# EAGLE schematic ReflowOvenController (EAGLE 6.4)
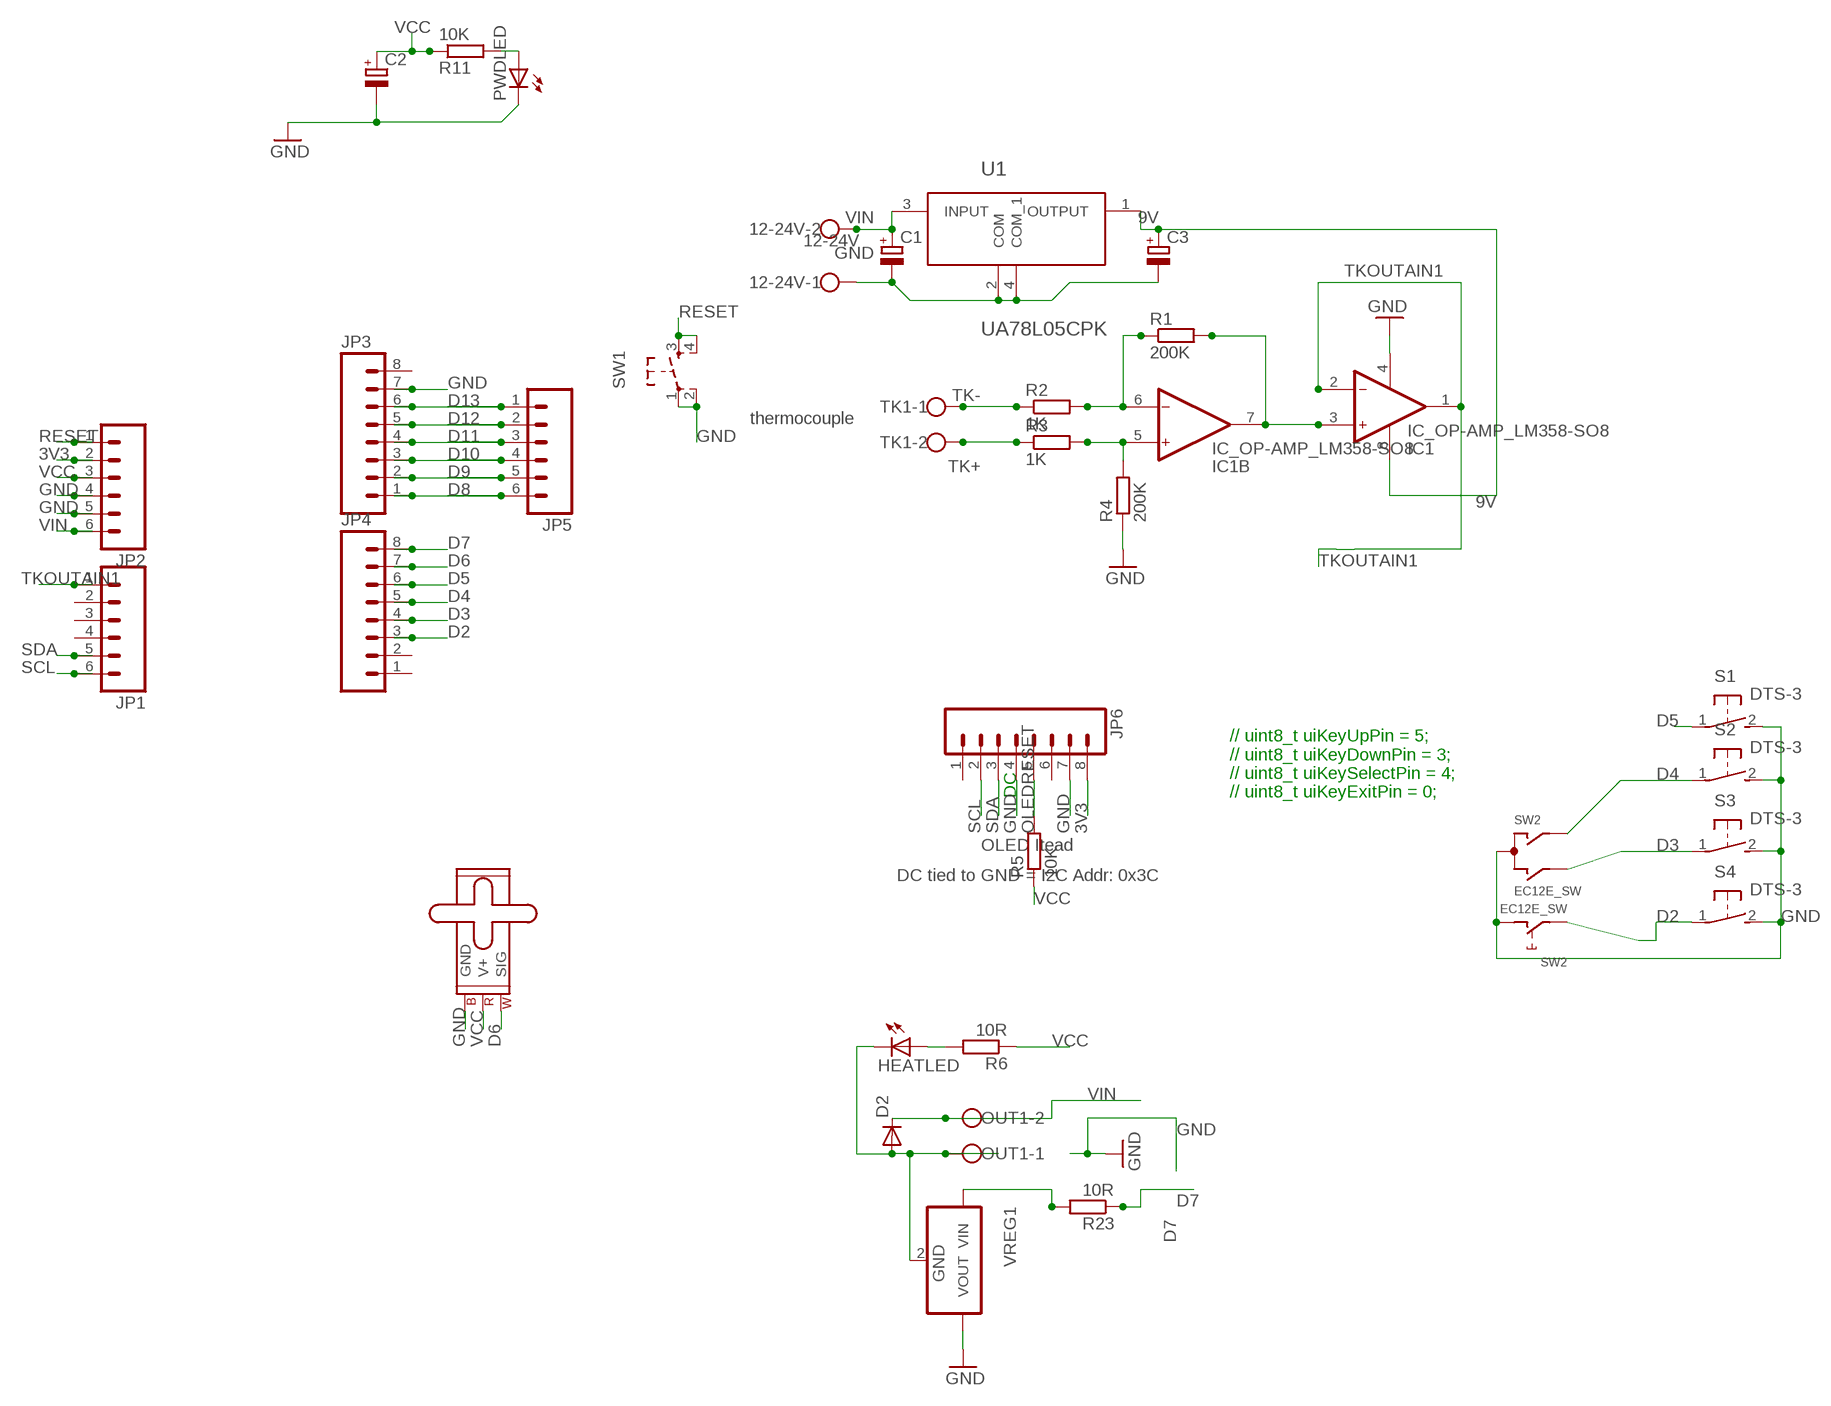
[diagram p0: schematic, sheet 1]

## Parts
12-24V  W237-102  [W237-102]
C1  CPOL-EU153CLV-0505  [153CLV-0505]
C2  CPOL-EU153CLV-0505  [153CLV-0505]
C3  CPOL-EU153CLV-0505  [153CLV-0505]
D2  DIODESMA-ALT  [SMA-DIODE_ALT]
HEATLED  LEDCHIPLED_1206  [CHIPLED_1206]
IC1  IC_OP-AMP_LM358-SO8  [SO-8]
JP1  M06LOCK_LONGPADS  [1X06_LOCK_LONGPADS]
JP2  M06LOCK_LONGPADS  [1X06_LOCK_LONGPADS]
JP3  M08LOCK_LONGPADS  [1X08_LOCK_LONGPADS]
JP4  M08LOCK_LONGPADS  [1X08_LOCK_LONGPADS]
JP5  M06LOCK_LONGPADS  [1X06_LOCK_LONGPADS]
JP6  M08LOCK  [1X08_LOCK]
OUT1  W237-102  [W237-102]
PWDLED  LEDCHIPLED_1206  [CHIPLED_1206]
R1  200K  R-EU_M1206  [M1206]
R2  1K  R-EU_M1206  [M1206]
R3  1K  R-EU_M1206  [M1206]
R4  200K  R-EU_M1206  [M1206]
R5  10K  RESISTOR-1206  [R1206]
R6  10R  R-EU_M1206  [M1206]
R11  10K  RESISTOR-1206  [R1206]
R23  10R  R-EU_M1206  [M1206]
S1  DTS-3  [DTS-3]
S2  DTS-3  [DTS-3]
S3  DTS-3  [DTS-3]
S4  DTS-3  [DTS-3]
SERVO  SMALL_SERVO  [1X03]
SW1  SW_TACT_4P  [SW_TACT_SMALL]
SW2  EC12E_SW  [ALPS_EC12E_SW]
TK1  W237-102  [W237-102]
U1  UA78L05CPK  [SOT150P400X160-4N]
VREG1  VREG_3PINS-D2PAK  [D2PAK]

## Nets
3V3: JP2.2 JP6.8
9V: C3.+ IC1.8(V+) U1.1(OUTPUT)
D2: JP4.3 S4.1 SW2.E
D3: JP4.4 S3.1 SW2.B
D4: JP4.5 S2.1 SW2.A
D5: JP4.6 S1.1
D6: JP4.7 SERVO.1(SIG)
D7: JP4.8 R23.1
D8: JP3.1 JP5.6
D9: JP3.2 JP5.5
D10: JP3.3 JP5.4
D11: JP3.4 JP5.3
D12: JP3.5 JP5.2
D13: JP3.6 JP5.1
GND: 12-24V.1 C1.- C2.- C3.- IC1.4(V-) JP2.4 JP2.5 JP3.7 JP6.4 JP6.7 PWDLED.C R4.1 S1.2 S2.2 S3.2 S4.2 SERVO.3(GND) SW1.1 SW1.2 SW2.C SW2.D U1.2(COM) U1.4(COM_1) VREG1.3(VOUT)
MSFTOUT1: D2.A HEATLED.C OUT1.1 VREG1.2(GND)
N$1: IC1.3(+) IC1.7(OUT) R1.2
N$2: IC1.6(-) R1.1 R2.2
N$3: IC1.5(+) R3.2 R4.2
N$4: HEATLED.A R6.2
N$12: PWDLED.A R11.2
N$43: R23.2 VREG1.1(VIN)
OLEDRESET: JP6.5 R5.2
RESET: JP2.1 SW1.3 SW1.4
SCL: JP1.6 JP6.2
SDA: JP1.5 JP6.3
TK+: R3.1 TK1.2
TK-: R2.1 TK1.1
TKOUTAIN1: IC1.1(OUT) IC1.2(-) JP1.1
VCC: C2.+ JP2.3 R5.1 R6.1 R11.1 SERVO.2(V+)
VIN: 12-24V.2 C1.+ D2.C JP2.6 OUT1.2 U1.3(INPUT)
Unconnected: JP1.2 JP1.3 JP1.4 JP3.8 JP4.1 JP4.2 JP6.1 JP6.6 SW2.GND1(G) SW2.GND2(G)

## Notes on the sheet
- 12-24V
- thermocouple
- DC
- // uint8_t uiKeyUpPin = 5;
  // uint8_t uiKeyDownPin = 3;
  // uint8_t uiKeySelectPin = 4;
  // uint8_t uiKeyExitPin = 0;
- OLED Itead
- DC tied to GND = I2C Addr: 0x3C

## Library data of the parts
12-24V OUT1 TK1 = con-wago-500:W237-102: WAGO SCREW CLAMP; MPN: 237-102; OC_FARNELL: unknown; OC_NEWARK: 70K9898
C1-C3 = resistor:CPOL-EU: POLARIZED CAPACITOR, European symbol
D2 = SparkFun-DiscreteSemi:DIODE: Diode These are standard reverse protection diodes and small signal diodes. SMA package can handle up to about 1A. SOD-323 can handle about 200mA. What the SOD-323 package when ordering, there are some mfgs out there that are 5-pin packages.
HEATLED PWDLED = led:LED: LED OSRAM: - CHIPLED LG R971, LG N971, LY N971, LG Q971, LY Q971, LO R971, LY R971 LH N974, LH R974 LS Q976, LO Q976, LY Q976 LO Q996 - Hyper CHIPLED LW Q18S LB Q993, LB Q99A, LB R99A - SideLED LS A670, LO A670, LY A670, LG A670, LP A670 LB A673, LV A673, LT A673, LW A673 LH A674 LY A675 LS A676, LA A676, LO A676, LY A676, LW A676 LS A679, LY A679, LG A679 - Hyper Micro SIDELED® LS Y876, LA Y876, LO Y876, LY Y876 LT Y87S - SmartLED LW L88C, LW L88S LB L89C, LB L89S, LG L890 LS L89K, LO L89K, LY L89K LS L896, LA L896, LO L896, LY L896 - TOPLED LS T670, LO T670, LY T670, LG T670, LP T670 LSG T670, LSP T670, LSY T670, LOP T670, LYG T670 LG T671, LOG T671, LSG T671 LB T673, LV T673, LT T673, LW T673 LH T674 LS T676, LA T676, LO T676, LY T676, LB T676, LH T676, LSB T676, LW T676 LB T67C, LV T67C, LT T67C, LS T67K, LO T67K, LY T67K, LW E67C LS E67B, LA E67B, LO E67B, LY E67B, LB E67C, LV E67C, LT E67C LW T67C LS T679, LY T679, LG T679 LS T770, LO T770, LY T770, LG T770, LP T770 LB T773, LV T773, LT T773, LW T773 LH T774 LS E675, LA E675, LY E675, LS T675 LS T776, LA T776, LO T776, LY T776, LB T776 LHGB T686 LT T68C, LB T68C - Hyper Mini TOPLED® LB M676 - Mini TOPLED Santana® LG M470 LS M47K, LO M47K, LY M47K Source: http://www.osram.convergy.de LUXEON: - LUMILED® LXK2-PW12-R00, LXK2-PW12-S00, LXK2-PW14-U00, LXK2-PW14-V00 LXK2-PM12-R00, LXK2-PM12-S00, LXK2-PM14-U00 LXK2-PE12-Q00, LXK2-PE12-R00, LXK2-PE12-S00, LXK2-PE14-T00, LXK2-PE14-U00 LXK2-PB12-K00, LXK2-PB12-L00, LXK2-PB12-M00, LXK2-PB14-N00, LXK2-PB14-P00, LXK2-PB14-Q00 LXK2-PR12-L00, LXK2-PR12-M00, LXK2-PR14-Q00, LXK2-PR14-R00 LXK2-PD12-Q00, LXK2-PD12-R00, LXK2-PD12-S00 LXK2-PH12-R00, LXK2-PH12-S00 LXK2-PL12-P00, LXK2-PL12-Q00, LXK2-PL12-R00 Source: www.luxeon.com KINGBRIGHT: KA-3528ASYC Source: www.kingbright.com
IC1 = dp_devices:IC_OP-AMP_LM358: Dual op-amp
JP1 JP2 JP5 = SparkFun-Connectors:M06: Header 6 Standard 6-pin 0.1" header. Use with straight break away headers (SKU : PRT-00116), right angle break away headers (PRT-00553), swiss pins (PRT-00743), machine pins (PRT-00117), and female headers (PRT-00115). Molex polarized connector foot print use with SKU : PRT-08094 with associated crimp pins and housings. NOTES ON THE VARIANTS LOCK and LOCK_LONGPADS... This footprint was designed to help hold the alignment of a through-hole component (i.e. 6-pin header) while soldering it into place. You may notice that each hole has been shifted either up or down by 0.005 of an inch from it's more standard position (which is a perfectly straight line). This slight alteration caused the pins (the squares in the middle) to touch the edges of the holes. Because they are alternating, it causes a "brace" to hold the component in place. 0.005 has proven to be the perfect amount of "off-center" position when using our standard breakaway headers. Although looks a little odd when you look at the bare footprint, once you have a header in there, the alteration is very hard to notice. Also,if you push a header all the way into place, it is covered up entirely on the bottom side. This idea of altering the position of holes to aid alignment will be further integrated into the Sparkfun Library for other footprints. It can help hold any component with 3 or more connection pins.
JP3 JP4 JP6 = SparkFun-Connectors:M08: Header 8 Standard 8-pin 0.1" header. Use with straight break away headers (SKU : PRT-00116), right angle break away headers (PRT-00553), swiss pins (PRT-00743), machine pins (PRT-00117), and female headers (PRT-00115).
R1-R4 R6 R23 = resistor:R-EU_: RESISTOR, European symbol
R5 R11 = dp_devices:RESISTOR
S1-S4 = switch-tact:DTS-3
SERVO = SparkFun-Electromechanical:SMALL_SERVO: Small servo motor This is the small servo used in the SIK. SKU: ROB-09065
SW1 = dp_devices:SW_TACT_4P
SW2 = switch-alps:EC12E_SW: ALPS rotary Encoder EC12E series with switch; MPN: EC12E2424407; OC_FARNELL: 1520813; OC_NEWARK: 74M1068
U1 = TI-Eagle_library:UA78L05: μA78L00 SERIES POSITIVE-VOLTAGE REGULATORS,SOT-89-3; MPN: UA78L05CPK; OC_FARNELL: 2112604; OC_NEWARK: 77C1862; PACKAGE: SOT-89-3; SUPPLIER: TEXAS INSTRUMENTS
VREG1 = dp_devices:VREG_3PINS: Various 3 pin voltage regulators in different packages Double check the right pinout for the right part